# EAGLE design w13_atmega328 (EAGLE 8.0.1)
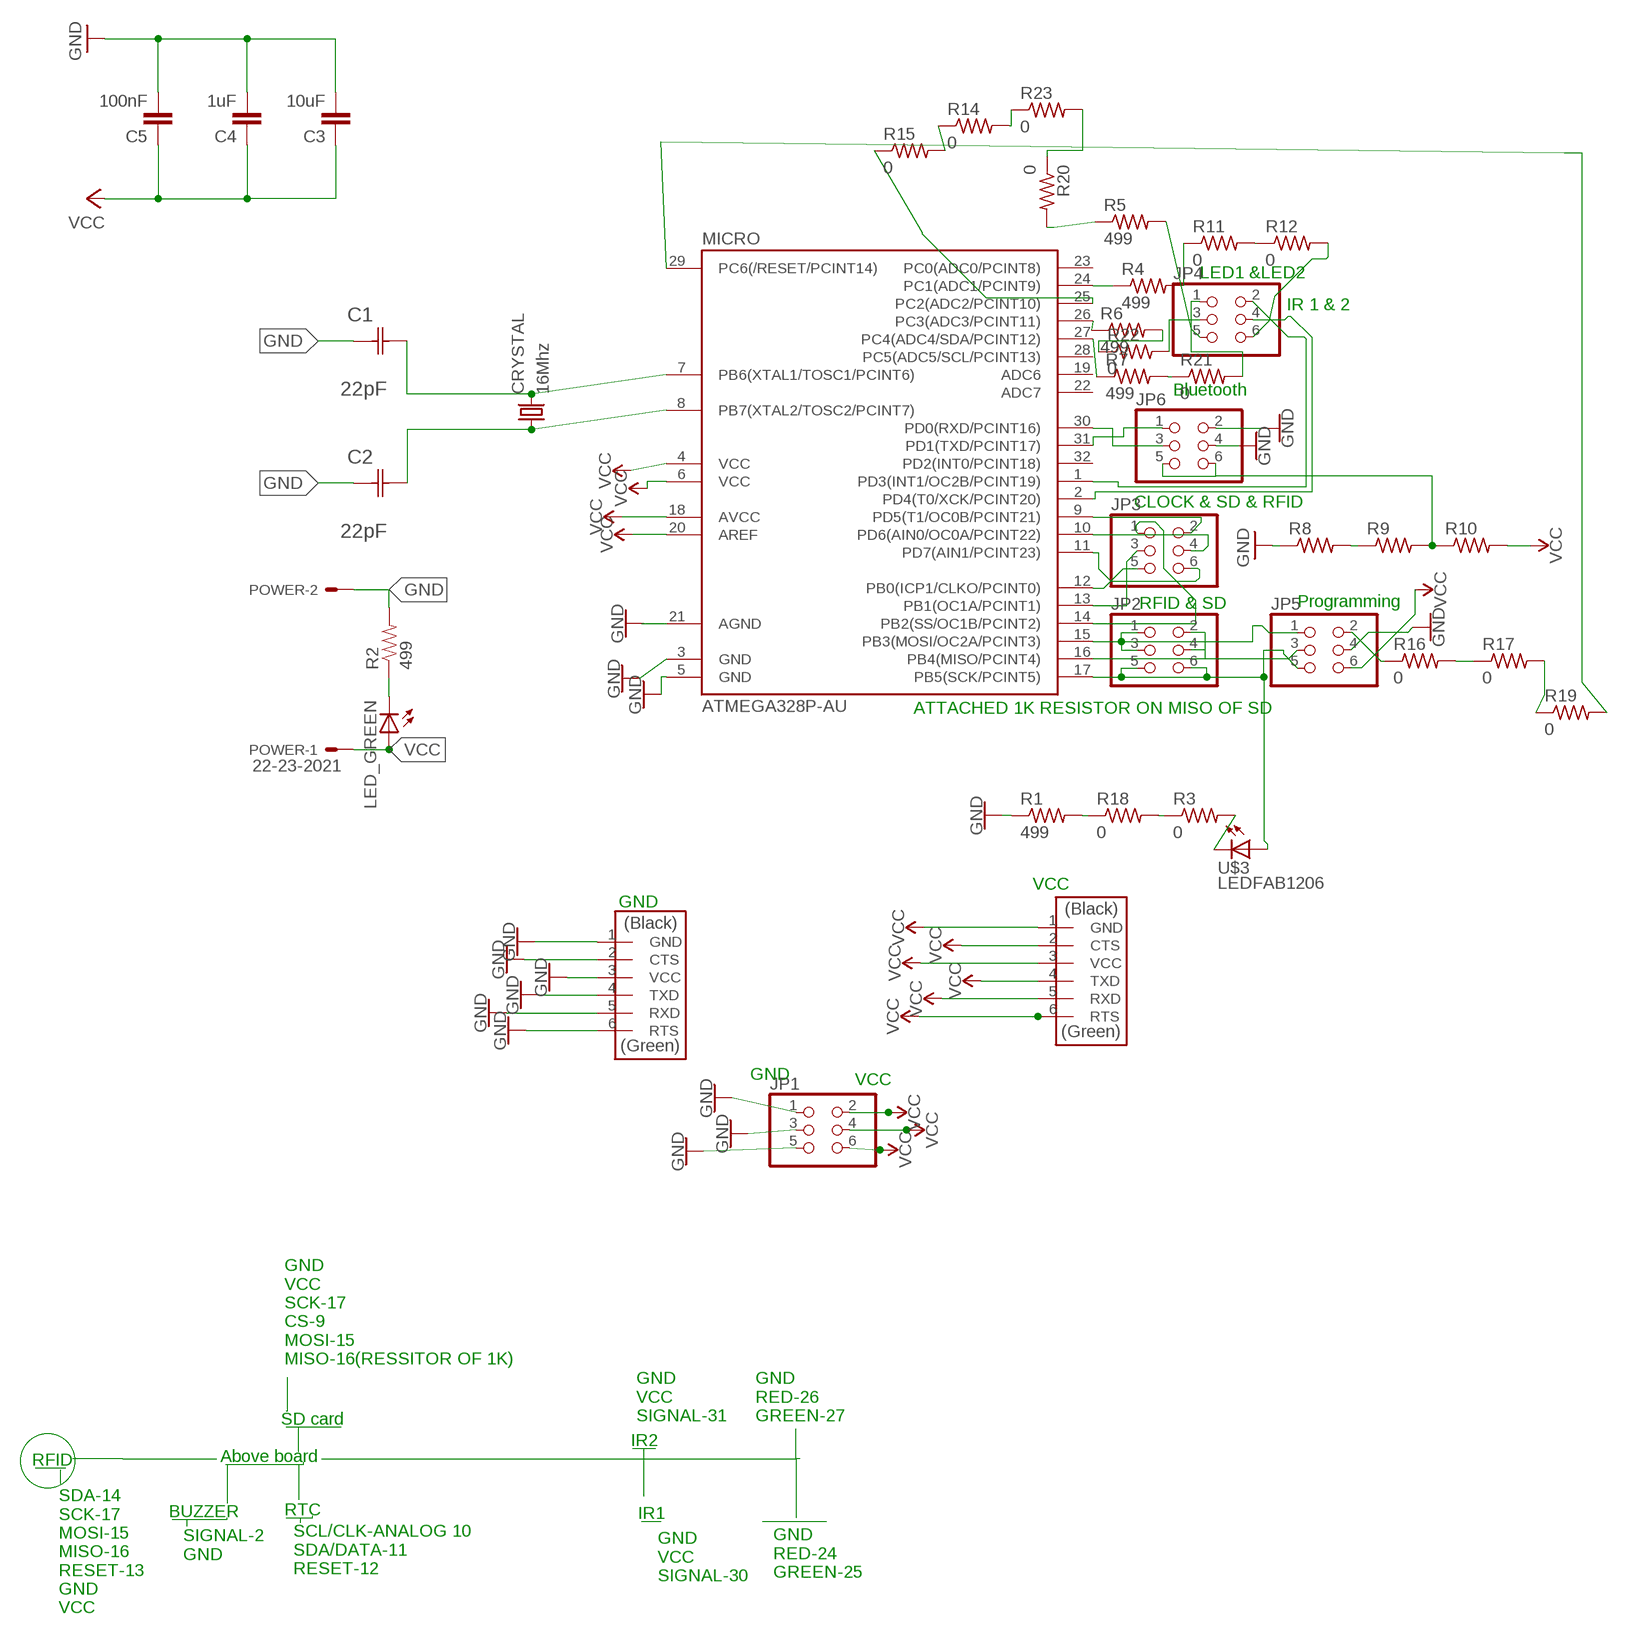
[diagram p0: schematic, sheet 1]

## Parts
C1  22pF  0612ZC225MAT2A  [CAPC3216X178N]
C2  22pF  0612ZC225MAT2A  [CAPC3216X178N]
C3  10uF  CAP1206  [1206]
C4  1uF  CAP1206  [1206]
C5  100nF  CAP1206  [1206]
CRYSTAL  16Mhz  CSM-7X-DU  [CSM-7X-DU]
JP1  PINHD-2X3-SMD  [2X03SMD]
JP2  PINHD-2X3-SMD  [2X03SMD]
JP3  PINHD-2X3-SMD  [2X03SMD]
JP4  PINHD-2X3-SMD  [2X03SMD]
JP5  PINHD-2X3-SMD  [2X03SMD]
JP6  PINHD-2X3-SMD  [2X03SMD]
LED_GREEN  LED1206  [1206]
MICRO  ATMEGA328P-AU  ATMEGA48/88/168-AU  [TQFP32-08]
POWER  22-23-2021  [22-23-2021]
R1  499  RES-US1206  [R1206]
R2  499  RESISTOR1206  [1206]
R3  0  RES-US1206FAB  [R1206FAB]
R4  499  RES-US1206FAB  [R1206FAB]
R5  499  RES-US1206FAB  [R1206FAB]
R6  499  RES-US1206FAB  [R1206FAB]
R7  499  RES-US1206FAB  [R1206FAB]
R8  RES-US1206FAB  [R1206FAB]
R9  RES-US1206FAB  [R1206FAB]
R10  RES-US1206FAB  [R1206FAB]
R11  0  RES-US1206FAB  [R1206FAB]
R12  0  RES-US1206FAB  [R1206FAB]
R14  0  RES-US1206FAB  [R1206FAB]
R15  0  RES-US1206FAB  [R1206FAB]
R16  0  RES-US1206FAB  [R1206FAB]
R17  0  RES-US1206FAB  [R1206FAB]
R18  0  RES-US1206FAB  [R1206FAB]
R19  0  RES-US1206FAB  [R1206FAB]
R20  0  RES-US1206FAB  [R1206FAB]
R21  0  RES-US1206FAB  [R1206FAB]
R22  0  RES-US1206FAB  [R1206FAB]
R23  0  RES-US1206FAB  [R1206FAB]
U$1  FTDI-SMD-HEADER  [1X06SMD]
U$2  FTDI-SMD-HEADER  [1X06SMD]
U$3  LEDFAB1206  [LED1206FAB]

## Nets
GND: C1.1(C1) C2.1(C1) C3.2 C4.2 C5.2 JP1.1 JP1.3 JP1.5 JP5.4 JP6.2 JP6.4 MICRO.3(GND) MICRO.5(GND) POWER.2 R1.1 R2.2 R8.1 U$1.1(GND) U$1.2(CTS) U$1.3(VCC) U$1.4(TXD) U$1.5(RXD) U$1.6(RTS)
N$1: R4.2 R11.1
N$2: C1.2(C2) CRYSTAL.2 MICRO.7(PB6(XTAL1/TOSC1/PCINT6))
N$3: JP2.1 JP2.3 JP5.1 MICRO.15(PB3(MOSI/OC2A/PCINT3))
N$4: JP3.1 MICRO.14(PB2(SS/OC1B/PCINT2))
N$5: JP3.3 MICRO.13(PB1(OC1A/PCINT1))
N$6: JP3.5 MICRO.12(PB0(ICP1/CLKO/PCINT0))
N$7: JP3.6 MICRO.11(PD7(AIN1/PCINT23))
N$8: JP3.2 MICRO.9(PD5(T1/OC0B/PCINT21))
N$9: C2.2(C2) CRYSTAL.1 MICRO.8(PB7(XTAL2/TOSC2/PCINT7))
N$10: JP2.5 JP2.6 JP5.5 MICRO.17(PB5(SCK/PCINT5)) U$3.1(A)
N$11: JP3.4 MICRO.10(PD6(AIN0/OC0A/PCINT22))
N$12: MICRO.29(PC6(/RESET/PCINT14)) R19.2
N$13: R1.2 R18.1
N$14: MICRO.24(PC1(ADC1/PCINT9)) R4.1
N$15: MICRO.25(PC2(ADC2/PCINT10)) R15.1
N$16: MICRO.26(PC3(ADC3/PCINT11)) R6.1
N$17: JP6.3 MICRO.30(PD0(RXD/PCINT16))
N$18: JP6.1 MICRO.31(PD1(TXD/PCINT17))
N$19: MICRO.27(PC4(ADC4/SDA/PCINT12)) R7.1
N$20: MICRO.21(AGND)
N$26: LED_GREEN.2(C) R2.1
N$37: JP4.5 R5.2
N$40: JP4.3 R22.2
N$41: JP4.6 R12.2
N$42: JP4.2 MICRO.1(PD3(INT1/OC2B/PCINT19))
N$43: R3.2 U$3.2(C)
N$44: JP4.1 R21.2
N$45: R8.2 R9.1
N$46: JP6.5 JP6.6 R9.2 R10.1
N$47: JP4.4 MICRO.2(PD4(T0/XCK/PCINT20))
N$48: R11.2 R12.1
N$49: JP2.2 JP2.4 JP5.3 MICRO.16(PB4(MISO/PCINT4))
N$51: R14.1 R15.2
N$52: R14.2 R23.1
N$53: JP5.2 R16.1
N$54: R16.2 R17.1
N$55: R3.1 R18.2
N$56: R17.2 R19.1
N$57: R5.1 R20.2
N$58: R7.2 R21.1
N$59: R6.2 R22.1
N$60: R20.1 R23.2
VCC: C3.1 C4.1 C5.1 JP1.2 JP1.4 JP1.6 JP5.6 LED_GREEN.1(A) MICRO.4(VCC) MICRO.6(VCC) MICRO.18(AVCC) MICRO.20(AREF) POWER.1 R10.2 U$2.1(GND) U$2.2(CTS) U$2.3(VCC) U$2.4(TXD) U$2.5(RXD) U$2.6(RTS)
Unconnected: MICRO.19(ADC6) MICRO.22(ADC7) MICRO.23(PC0(ADC0/PCINT8)) MICRO.28(PC5(ADC5/SCL/PCINT13)) MICRO.32(PD2(INT0/PCINT18))

## Notes on the sheet
- LED1 &LED2
- IR 1 & 2
- Bluetooth
- CLOCK & SD & RFID
- RFID & SD | Programming
- ATTACHED 1K RESISTOR ON MISO OF SD
- VCC
- GND
- GND
- VCC
- GND
  VCC
  SCK-17
  CS-9
  MOSI-15
  MISO-16(RESSITOR OF 1K)
- GND
  VCC
  SIGNAL-31
- GND
  RED-26
  GREEN-27
- SD card
- IR2
- RFID | Above board
- BUZZER | RTC | IR1
- SIGNAL-2
  GND
- SCL/CLK-ANALOG 10
  SDA/DATA-11
  RESET-12
- GND
  RED-24
  GREEN-25
- GND
  VCC
  SIGNAL-30
- SDA-14
  SCK-17
  MOSI-15
  MISO-16
  RESET-13
  GND
  VCC

## Library data of the parts
C1 C2 = AVX_By_element14_Batch_1:0612ZC225MAT2A: Capacitor 1206; MPN: 0612ZC225MAT2A; OC_FARNELL: -; OC_NEWARK: 12N3209; SUPPLIER: AVX; TOLERANCE: ±20%; VALUE: 2.2µF; VOLTAGERATING: 10V
C3-C5 = 01_SparkFun:CAP: Capacitor Standard 0603 ceramic capacitor, and 0.1" leaded capacitor.
CRYSTAL = 01_FAB_Hello:CSM-7X-DU: SMD CRYSTAL Source: www.ecsxtal.com .. Crystal 3.6864MHz CSM_7X_DU.PDF; OC_FARNELL: unknown; OC_NEWARK: unknown
JP1-JP6 = fab:PINHD-2X3-SMD: PIN HEADER
LED_GREEN = 01_FAB_Hello:LED
MICRO = atmega8:ATMEGA48/88/168
POWER = con-molex:22-23-2021: .100" (2.54mm) Center Header - 2 Pin; MF: MOLEX; MPN: 22-23-2021; OC_FARNELL: 1462926; OC_NEWARK: 25C3832
R1 R4-R12 R14-R23 = fab:RES-US: Resistor (US Symbol) Variants with postfix FAB are widened to allow the routing of internal traces
R2 = 01_SparkFun:RESISTOR: Resistor Basic schematic elements and footprints for 0603, 1206, and PTH 1/10th watt (small) resistors.
R3 = fab:RES-US: Resistor (US Symbol) Variants with postfix FAB are widened to allow the routing of internal traces; RESISTOR: 0
U$1 U$2 = fab:FTDI-SMD-HEADER
U$3 = fab:LED: LED

## Board
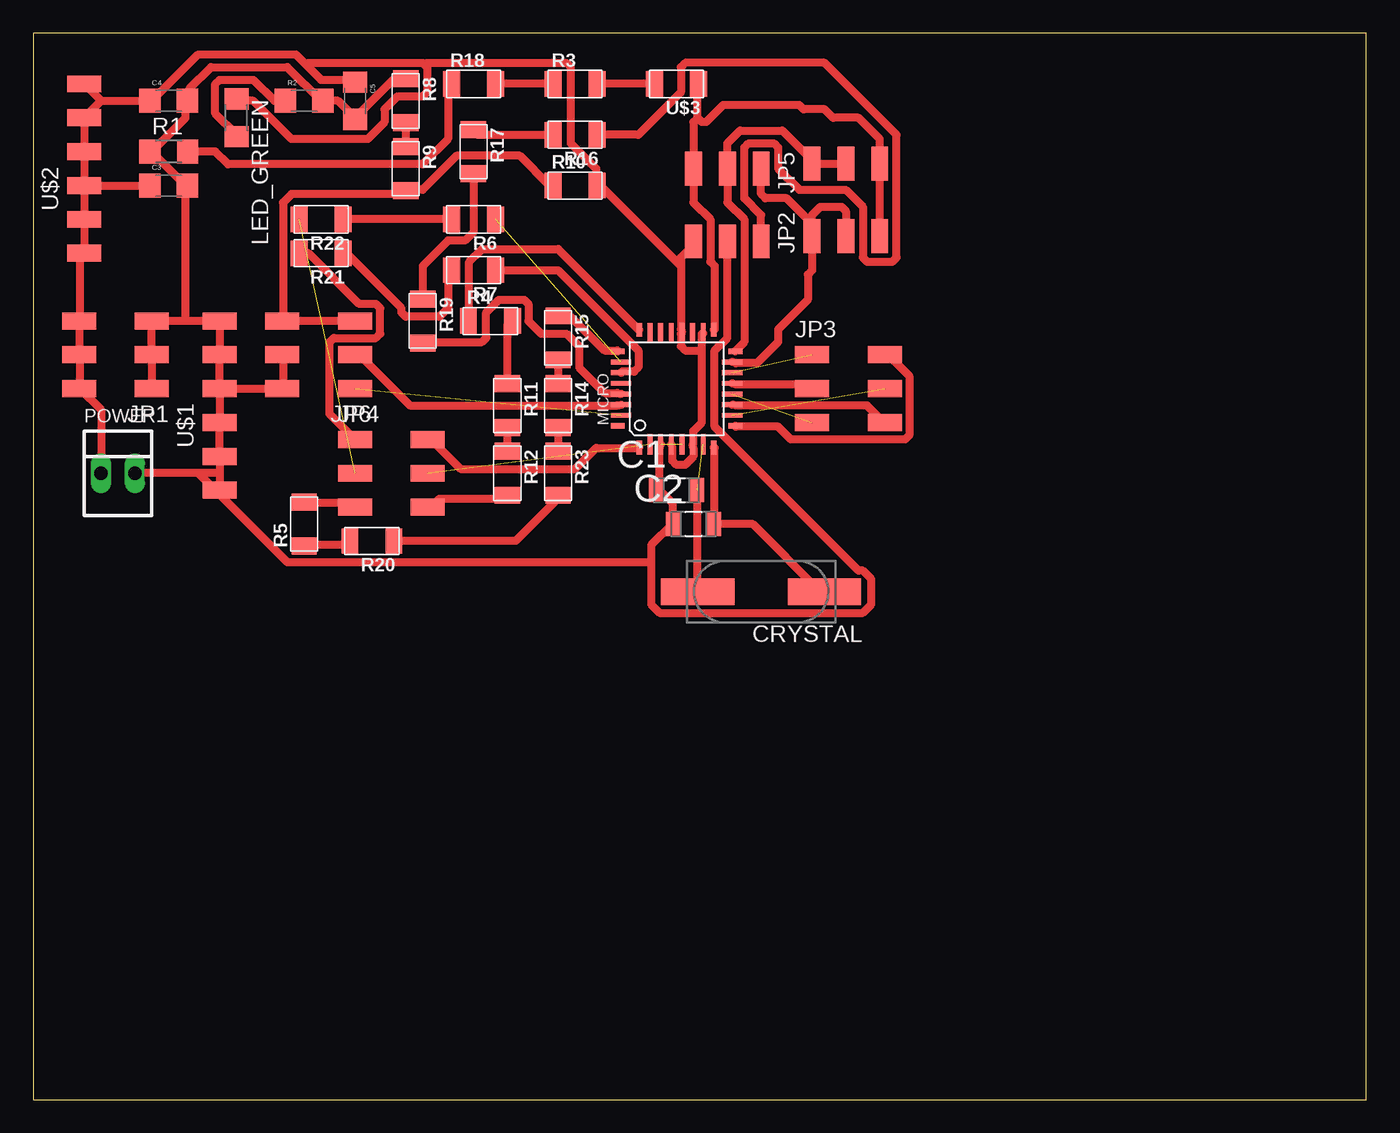
[diagram p1: board, top side]

Size 100 x 80 mm. Coordinates in mm from the lower left corner, seen from the top.
Outline: 0,0 100,0 100,80 0,80 0,0
Copper layers (1*16): Top 0.035mm / dielectric 1.5mm / Bottom 0.035mm
Design rules "default *": minimum track width 0.6mm, minimum drill 24mil, track to track 0.3mm, track to pad 0.2mm, pad to pad 0.2mm, via to via 0.2mm, smd to smd 0.2mm, copper to edge 40mil, drill to drill 8mil, minimum pad ring 10mil, minimum via ring 8mil, stop-mask expansion 4mil, vias tented up to drill 0mil, thermal gap 10mil

### Footprints (pad centres in the part's own frame; a part is rotated, then mirrored left to right if it is on the bottom)
CAPC3216X178N = smd 1.118 x 1.803: 1 -1.499,0; 2 1.499,0
1206 = smd 1.6 x 1.8: 1 -1.4,0; 2 1.4,0
CSM-7X-DU = smd 5.5 x 2: 1 -4.75,0; 2 4.75,0
2X03SMD = smd 2.54 x 1.27: 1 -2.54,2.54; 2 2.92,2.54; 3 -2.54,0; 4 2.92,0; 5 -2.54,-2.54; 6 2.92,-2.54
1206' = smd 1.6 x 1.803: 1 -1.422,0; 2 1.422,0
TQFP32-08 = smd 1.016 x 0.406: 1 -4.42,2.8; 8 -4.42,-2.8; 17 4.42,-2.8; 24 4.42,2.8 | smd 1.524 x 0.356: 2 -4.166,2; 3 -4.166,1.2; 4 -4.166,0.4; 5 -4.166,-0.4; 6 -4.166,-1.2; 7 -4.166,-2; 18 4.166,-2; 19 4.166,-1.2; 20 4.166,-0.4; 21 4.166,0.4; 22 4.166,1.2; 23 4.166,2 | smd 0.406 x 1.016: 9 -2.8,-4.42; 16 2.8,-4.42; 25 2.8,4.42; 32 -2.8,4.42 | smd 0.356 x 1.524: 10 -2,-4.166; 11 -1.2,-4.166; 12 -0.4,-4.166; 13 0.4,-4.166; 14 1.2,-4.166; 15 2,-4.166; 26 2,4.166; 27 1.2,4.166; 28 0.4,4.166; 29 -0.4,4.166; 30 -1.2,4.166; 31 -2,4.166
22-23-2021 = drill 1 long: 1 -1.27,0; 2 1.27,0
R1206 = smd 1.6 x 1.803: 1 -1.422,0; 2 1.422,0
R1206FAB = smd 1.27 x 1.905: 1 -1.651,0; 2 1.651,0
1X06SMD = smd 2.54 x 1.27: 1 0,6.35; 2 0,3.81; 3 0,1.27; 4 0,-1.27; 5 0,-3.81; 6 0,-6.35
LED1206FAB = smd 1.27 x 1.905: 1 -1.651,0; 2 1.651,0

### Placement (x,y rotation side)
C1  48.26,45.72 0 top
C2  49.53,43.18 0 top
C3  10.16,68.58 0 top
C4  10.16,74.93 0 top
C5  24.13,74.93 270 top
CRYSTAL  54.61,38.1 180 top
JP1  6.35,55.88 180 top
JP2  60.96,67.31 90 top
JP3  60.96,53.34 0 top
JP4  26.67,46.99 0 top
JP5  52.07,67.31 270 top
JP6  21.59,55.88 180 top
LED_GREEN  [1206']  15.24,73.66 270 top
MICRO  48.26,53.34 90 top
POWER  6.35,46.99 0 top
R1  10.16,71.12 0 top
R2  20.32,74.93 0 top
R3  40.64,76.2 0 top
R4  34.29,58.42 0 top
R5  20.32,43.18 90 top
R6  33.02,66.04 180 top
R7  33.02,62.23 180 top
R8  27.94,74.93 270 top
R9  27.94,69.85 270 top
R10  40.64,68.58 0 top
R11  35.56,52.07 270 top
R12  35.56,46.99 270 top
R14  39.37,52.07 270 top
R15  39.37,57.15 270 top
R16  40.64,72.39 180 top
R17  33.02,71.12 270 top
R18  33.02,76.2 0 top
R19  29.21,58.42 270 top
R20  25.4,41.91 180 top
R21  21.59,63.5 180 top
R22  21.59,66.04 180 top
R23  39.37,46.99 270 top
U$1  13.97,52.07 0 top
U$2  3.81,69.85 0 top
U$3  48.26,76.2 180 top

### Tracks (layer width: path | path; a pad name or v marks a point on that pad's centre or on a via)
GND  (1 unrouted)
  Top 0.6: 46.99,45.72 46.99,48.9 MICRO.3 | 47.94,43.18 47.94,44.77 46.99,45.72 | 46.99,45.72 C1.1 | JP5.4 52.07,57.15 51.12,56.2 51.12,50.48 61.91,39.69 62.23,39.69 62.87,39.05 62.87,37.15 62.23,36.51 46.99,36.51 46.35,37.15 46.35,40.32 | 46.35,40.32 46.35,41.59 47.94,43.18 | 47.94,43.18 C2.1 | 24.13,73.66 22.86,74.93 R2.2 21.59,74.93 19.05,77.47 13.34,77.47 11.75,75.88 11.75,74.93 C4.2 11.43,74.93 11.43,73.66 8.89,71.12 | 24.13,73.66 26.99,76.52 27.94,76.52 R8.1 | 24.13,73.66 C5.2 | 8.89,71.12 11.43,68.58 | 8.89,71.12 R1.1 | JP1.1 JP1.3 JP1.5 11.43,58.42 | JP6.4 18.73,55.88 18.73,53.34 JP6.2 U$1.3 | U$1.3 U$1.4 U$1.5 13.97,46.99 | 13.97,46.99 U$1.6 | 13.97,46.99 12.38,46.99 | 12.38,46.99 POWER.2 | U$1.3 U$1.2 U$1.1 11.43,58.42 | 11.43,58.42 11.43,68.58 | 11.43,68.58 C3.2 | 46.35,40.32 19.05,40.32 12.38,46.99
N$1
  Top 0.6: R11.1 35.56,58.1 35.88,58.42 R4.2
N$2  (1 unrouted)
  Top 0.6: C1.2 49.85,45.72 49.85,38.1 CRYSTAL.2
N$3
  Top 0.6: JP2.3 60.96,66.67 60.64,66.99 59.05,66.99 58.42,66.36 58.42,65.72 | MICRO.15 52.7,55.24 54.29,55.24 55.88,56.83 55.88,57.78 58.1,60.01 58.1,61.91 58.42,62.23 JP2.1 58.42,65.72 | JP5.1 54.61,67.94 54.93,67.63 56.52,67.63 58.42,65.72
N$4  (1 unrouted)
N$5
  Top 0.6: JP3.3 58.1,53.66 52.7,53.66 MICRO.13
N$6  (1 unrouted)
N$7
  Top 0.6: MICRO.11 52.7,52.07 62.55,52.07 63.82,50.8 JP3.6
N$8
  Top 0.6: MICRO.9 52.7,50.48 55.88,50.48 56.83,49.53 65.41,49.53 65.72,49.85 65.72,54.29 64.14,55.88 JP3.2
N$9
  Top 0.6: 51.12,43.18 51.12,48.9 MICRO.8 | 51.12,43.18 53.98,43.18 59.05,38.1 CRYSTAL.1 | 51.12,43.18 C2.2
N$10
  Top 0.6: MICRO.17 51.12,57.78 51.12,62.55 50.8,62.87 50.8,66.04 49.53,67.31 JP5.5 49.53,73.34 49.85,73.66 | JP2.5 JP2.6 63.5,72.07 61.91,73.66 60.01,73.66 59.37,74.3 57.78,74.3 57.47,74.61 51.75,74.61 50.48,73.34 50.16,73.34 49.85,73.66 | 49.85,73.66 49.85,76.2 U$3.1
N$11  (1 unrouted)
N$12
  Top 0.6: MICRO.29 43.81,53.02 42.86,53.02 40.96,54.93 40.96,56.52 40.01,57.47 38.1,57.47 37.15,58.42 37.15,59.69 36.83,60.01 34.92,60.01 33.97,59.05 33.97,57.15 33.66,56.83 29.21,56.83 R19.2
N$13
  Top 0.6: R1.2 13.65,71.12 14.61,70.17 29.21,70.17 31.11,72.07 31.11,76.2 R18.1
N$14
  Top 0.6: MICRO.24 45.4,57.78 39.37,63.82 33.66,63.82 32.7,62.87 32.7,58.42 R4.1
N$15
  Top 0.6: MICRO.25 43.81,56.2 42.86,56.2 40.32,58.74 39.37,58.74 R15.1
N$16  (1 unrouted)
N$17
  Top 0.6: JP6.3 24.45,55.88 28.26,52.07 43.81,52.07 MICRO.30
N$18  (1 unrouted)
N$19
  Top 0.6: R7.1 39.37,62.23 45.4,56.2 45.4,54.93 45.09,54.61 44.13,54.61 MICRO.27
N$26
  Top 0.6: R2.1 18.1,74.93 16.51,76.52 13.97,76.52 13.65,76.2 13.65,73.98 15.24,72.39 LED_GREEN.2
N$37
  Top 0.6: JP4.5 23.81,44.77 20.32,44.77 R5.2
N$40  (1 unrouted)
N$41
  Top 0.6: R12.2 35.56,45.09 30.48,45.09 29.84,44.45 JP4.6
N$42
  Top 0.6: MICRO.1 45.4,48.9 42.23,48.9 40.64,47.31 32.07,47.31 29.84,49.53 JP4.2
N$43
  Top 0.6: U$3.2 R3.2
N$44
  Top 0.6: R21.2 20.64,63.5 24.45,59.69 25.72,59.69 26.04,59.37 26.04,57.47 25.72,57.15 22.54,57.15 22.23,56.83 22.23,51.44 JP4.1
N$45
  Top 0.6: R8.2 R9.1
N$46
  Top 0.6: JP6.5 18.73,58.42 | R10.1 38.73,68.58 36.51,70.8 31.75,70.8 29.21,68.26 27.94,68.26 R9.2 27.94,67.94 19.37,67.94 18.73,67.31 18.73,58.42 | 18.73,58.42 JP6.6
N$47  (1 unrouted)
N$48
  Top 0.6: R11.2 R12.1
N$49
  Top 0.6: JP2.4 60.96,70.17 58.42,70.17 JP2.2 58.42,70.48 56.2,72.71 53.02,72.71 52.07,71.75 JP5.3 52.07,67.31 53.34,66.04 53.34,56.83 52.7,56.2 MICRO.16
N$51
  Top 0.6: R15.2 R14.1
N$52
  Top 0.6: R14.2 R23.1
N$53
  Top 0.6: R16.1 45.4,72.39 48.58,75.56 48.58,77.47 48.9,77.79 59.37,77.79 64.77,72.39 64.77,63.18 64.45,62.87 62.55,62.87 62.23,63.18 62.23,66.99 60.96,68.26 57.47,68.26 55.88,69.85 55.88,71.44 55.56,71.75 53.66,71.75 53.34,71.44 53.34,67.63 54.61,66.36 JP5.2
N$54
  Top 0.6: R16.2 33.34,72.39 33.02,72.71 R17.1
N$55
  Top 0.6: R3.1 R18.2
N$56
  Top 0.6: R19.1 29.21,62.55 31.11,64.45 32.38,64.45 33.02,65.09 R17.2
N$57
  Top 0.6: R5.1 20.32,41.59 23.18,41.59 23.5,41.91 R20.2
N$58
  Top 0.6: R21.1 23.5,63.5 27.62,59.37 27.62,59.05 27.94,58.74 30.48,58.74 31.11,59.37 31.11,62.23 R7.2
N$59
  Top 0.6: R6.2 R22.1
N$60
  Top 0.6: R20.1 36.2,41.91 39.37,45.09 R23.2
VCC
  Top 0.6: MICRO.4 47.94,48.9 47.94,47.94 48.26,47.62 48.9,47.62 49.53,48.26 49.53,48.9 MICRO.6 49.53,49.21 49.53,50.16 50.16,50.8 50.16,56.2 | 50.16,56.2 50.16,57.47 MICRO.18 | 48.58,62.55 48.58,63.18 49.53,64.14 JP5.6 | 48.58,62.55 48.58,57.78 MICRO.20 48.58,57.47 48.58,56.52 48.9,56.2 50.16,56.2 | 48.58,62.55 42.55,68.58 R10.2 42.23,68.58 42.23,69.85 40.32,71.75 40.32,77.47 40.01,77.79 29.53,77.79 29.37,77.63 | 3.49,55.88 3.49,53.34 | 3.49,55.88 3.49,58.42 | 3.49,55.88 JP1.4 | POWER.1 5.08,51.75 3.49,53.34 | 3.49,53.34 JP1.2 | U$2.4 C3.1 | U$2.4 U$2.5 U$2.6 3.49,63.18 3.49,58.42 | 5.08,74.93 C4.1 8.89,74.93 12.38,78.42 19.68,78.42 20.48,77.63 | U$2.1 5.08,74.93 | 20.48,77.63 21.59,76.52 24.13,76.52 C5.1 | 29.37,77.63 29.21,77.79 20.64,77.79 20.48,77.63 | 29.37,77.63 29.53,77.47 29.53,75.56 29.21,75.25 27.3,75.25 26.35,74.3 26.35,73.34 25.08,72.07 19.37,72.07 16.51,74.93 15.24,74.93 LED_GREEN.1 | 5.08,74.93 U$2.2 U$2.3 U$2.4 | 3.49,58.42 JP1.6